# Altium schematic sheet boots.SchDoc
size A4
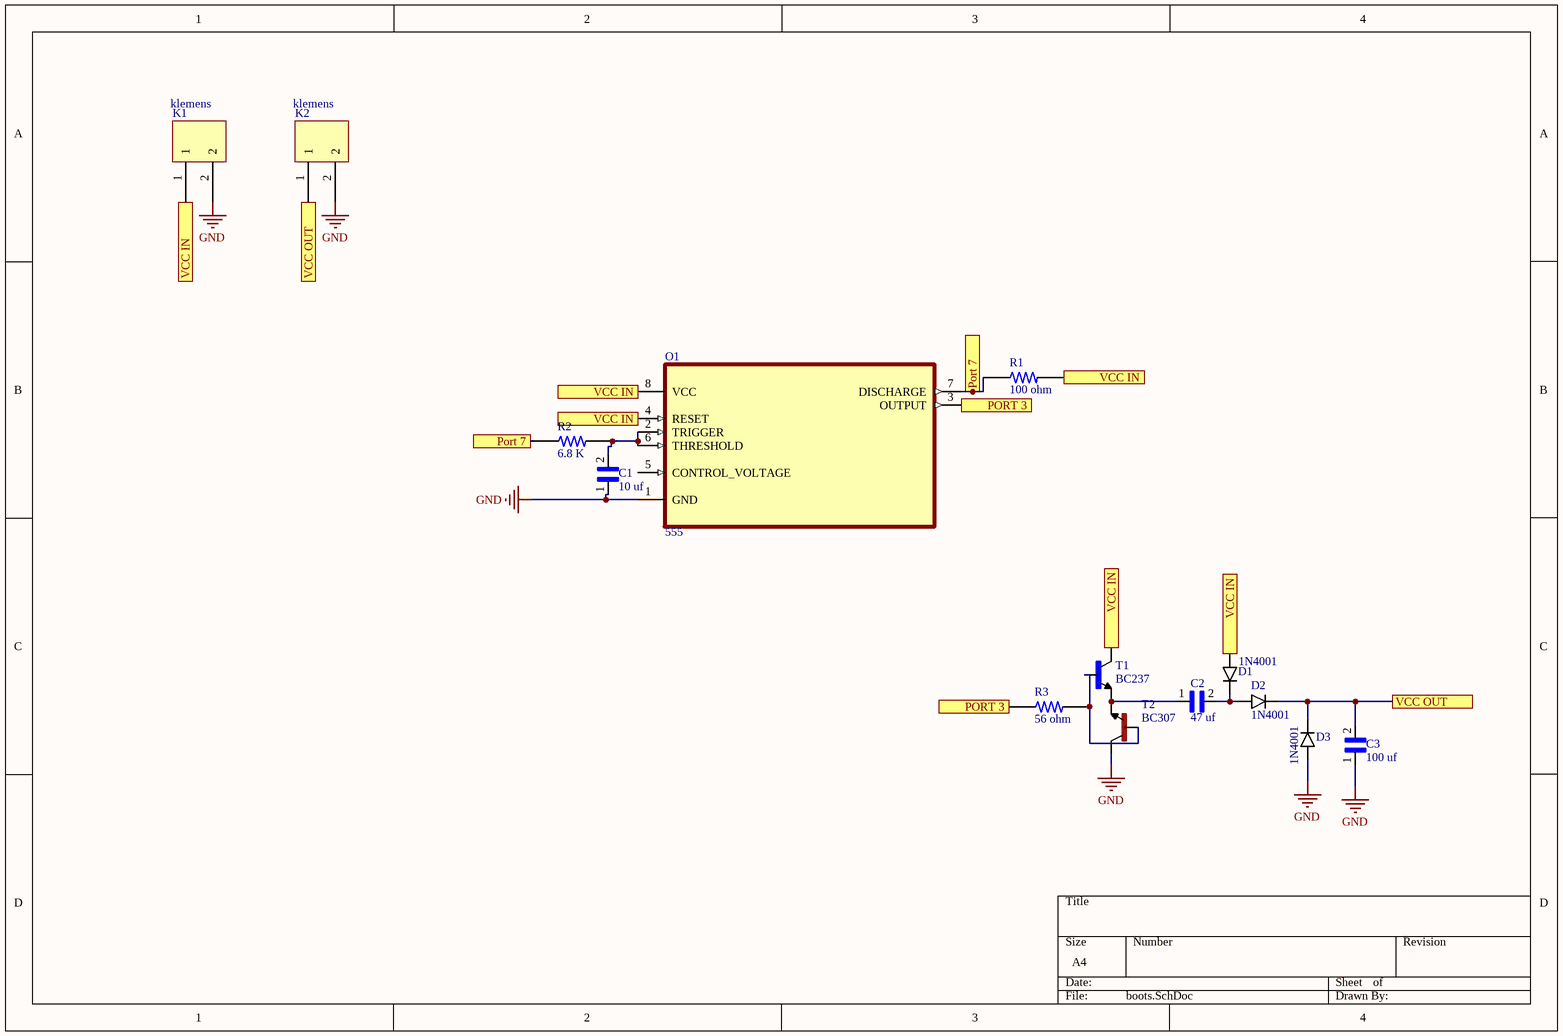
[diagram p0: boots.SchDoc]

## Parts
C1  10 uf  [100 uf]
C2  47 uf  [100 uf]
C3  100 uf  [100 uf]
D1  1N4001  [1N4001]
D2  1N4001  [1N4001]
D3  1N4001  [1N4001]
K1  klemens  [klemens]
K2  klemens  [klemens]
O1  555  [555]
R1  100 ohm  [100 ohm]
R2  6.8 K  [6.8 k]
R3  56 ohm  [56 ohm]
T1  BC237  [BC237]
T2  BC307  [BC307]

## Ports
PORT 3, Port 7, VCC IN, VCC OUT

## Nets
GND: C1.1 C3.1 D3.A(ANODE) K1.2 K2.2 O1.1(GND) T2.3(C)
PORT 3: O1.3(OUTPUT) R3.1 ; port PORT 3
Port 7: O1.7(DISCHARGE) R1.1 R2.1 ; port Port 7
VCC IN: D1.A(ANODE) K1.1 O1.4(RESET) O1.8(VCC) R1.2 T1.3(C) ; port VCC IN
VCC OUT: C3.2 D2.C(CATHODE) D3.C(CATHODE) K2.1 ; port VCC OUT
NetC1_2: C1.2 O1.2(TRIGGER) O1.6(THRESHOLD) R2.2
NetC2_1: C2.1 T1.1(E) T2.1(E)
NetC2_2: C2.2 D1.C(CATHODE) D2.A(ANODE)
NetR3_2: R3.2 T1.2(B) T2.2(B)

Not connected (* = marked no-connect by the designer): O1 5(CONTROL_VOLTAGE)

## Library data of the parts
C1 C2 = 100 uf